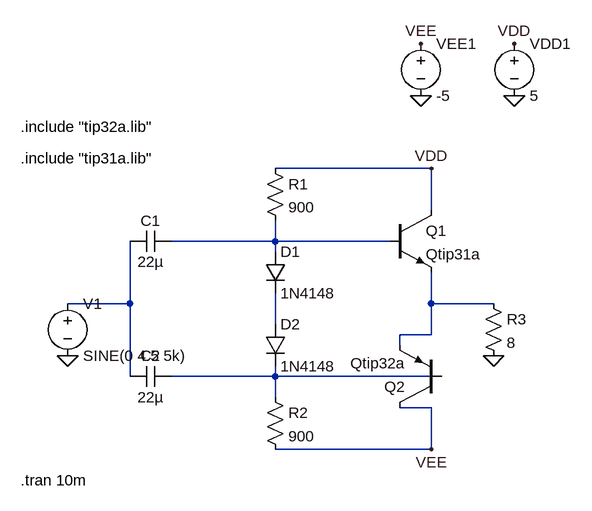
[diagram p0: schematic stage4.asc]
stage4.asc, the LTspice schematic file:
Version 4
SHEET 1 880 680
WIRE 384 -16 144 -16
WIRE 384 48 384 -16
WIRE 144 96 144 64
WIRE 144 96 -16 96
WIRE 320 96 144 96
WIRE 144 112 144 96
WIRE -80 192 -80 96
WIRE -80 192 -176 192
WIRE 384 192 384 144
WIRE 480 192 384 192
WIRE 144 224 144 176
WIRE 384 240 384 192
WIRE 384 240 336 240
WIRE 336 256 336 240
WIRE -80 304 -80 192
WIRE 144 304 144 288
WIRE 144 304 -16 304
WIRE 400 304 144 304
WIRE 144 336 144 304
WIRE 384 352 336 352
WIRE 384 416 384 352
WIRE 384 416 144 416
FLAG 368 -128 0
FLAG 368 -208 VEE
FLAG 512 -208 VDD
FLAG 512 -128 0
FLAG 384 -16 VDD
FLAG 384 416 VEE
FLAG 480 272 0
FLAG -176 272 0
SYMBOL diode 128 112 R0
SYMATTR InstName D1
SYMATTR Value 1N4148
SYMBOL diode 128 224 R0
SYMATTR InstName D2
SYMATTR Value 1N4148
SYMBOL res 128 -32 R0
SYMATTR InstName R1
SYMATTR Value 900
SYMBOL res 128 320 R0
SYMATTR InstName R2
SYMATTR Value 900
SYMBOL npn 320 48 R0
SYMATTR InstName Q1
SYMATTR Value Qtip31a
SYMBOL pnp 400 352 R180
SYMATTR InstName Q2
SYMATTR Value Qtip32a
SYMBOL cap -16 80 R90
WINDOW 0 0 32 VBottom 2
WINDOW 3 32 32 VTop 2
SYMATTR InstName C1
SYMATTR Value 22µ
SYMBOL cap -16 288 R90
WINDOW 0 0 32 VBottom 2
WINDOW 3 32 32 VTop 2
SYMATTR InstName C2
SYMATTR Value 22µ
SYMBOL voltage 368 -224 R0
WINDOW 123 0 0 Left 0
WINDOW 39 0 0 Left 0
SYMATTR InstName VEE1
SYMATTR Value -5
SYMBOL voltage 512 -224 R0
WINDOW 123 0 0 Left 0
WINDOW 39 0 0 Left 0
SYMATTR InstName VDD1
SYMATTR Value 5
SYMBOL res 464 176 R0
SYMATTR InstName R3
SYMATTR Value 8
SYMBOL voltage -176 176 R0
WINDOW 123 0 0 Left 0
WINDOW 39 0 0 Left 0
SYMATTR InstName V1
SYMATTR Value SINE(0 4.5 5k)
TEXT -248 -32 Left 2 !.include "tip31a.lib"
TEXT -248 -80 Left 2 !.include "tip32a.lib"
TEXT -248 464 Left 2 !.tran 10m

The netlist it stands for:
* stage4.asc
D1 N001 N004 1N4148
D2 N004 N005 1N4148
R1 VDD N001 900
R2 N005 VEE 900
Q1 VDD N001 N003 0 Qtip31a
Q2 VEE N005 N003 0 Qtip32a
C1 N001 N002 22µ
C2 N005 N002 22µ
VEE1 VEE 0 -5
VDD1 VDD 0 5
R3 N003 0 8
V1 N002 0 SINE(0 4.5 5k)
.model D D
.lib standard.dio
.model NPN NPN
.model PNP PNP
.lib standard.bjt
.include "tip31a.lib"
.include "tip32a.lib"
.tran 10m
.backanno
.end